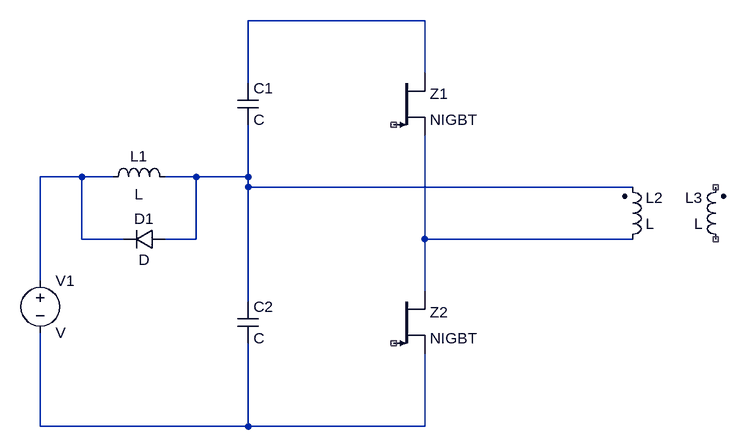
[diagram p0: schematic simulation_ltspice.asc]
simulation_ltspice.asc, the LTspice schematic file:
Version 4
SHEET 1 880 680
WIRE 352 48 80 48
WIRE 352 128 352 48
WIRE 80 144 80 48
WIRE -176 288 -240 288
WIRE -128 288 -176 288
WIRE 0 288 -48 288
WIRE 80 288 80 208
WIRE 80 288 0 288
WIRE 80 304 80 288
WIRE 672 304 80 304
WIRE -176 384 -176 288
WIRE -112 384 -176 384
WIRE 0 384 0 288
WIRE 0 384 -48 384
WIRE 352 384 352 224
WIRE 672 384 352 384
WIRE -240 448 -240 288
WIRE 352 464 352 384
WIRE 80 480 80 304
WIRE -240 672 -240 528
WIRE 80 672 80 544
WIRE 80 672 -240 672
WIRE 352 672 352 560
WIRE 352 672 80 672
SYMBOL Misc/NIGBT 304 128 R0
SYMATTR InstName Z1
SYMBOL Voltage -240 432 R0
SYMATTR InstName V1
SYMBOL ind -144 304 R270
WINDOW 0 32 56 VTop 2
WINDOW 3 5 56 VBottom 2
SYMATTR InstName L1
SYMBOL Diode -48 368 R90
WINDOW 0 0 32 VBottom 2
WINDOW 3 32 32 VTop 2
SYMATTR InstName D1
SYMBOL Misc/NIGBT 304 464 R0
SYMATTR InstName Z2
SYMBOL Cap 64 144 R0
SYMATTR InstName C1
SYMBOL Cap 64 480 R0
SYMATTR InstName C2
SYMBOL ind2 656 400 M180
WINDOW 0 36 80 Left 2
WINDOW 3 36 40 Left 2
SYMATTR InstName L2
SYMBOL ind2 816 400 R180
WINDOW 0 36 80 Left 2
WINDOW 3 36 40 Left 2
SYMATTR InstName L3

The netlist it stands for:
* simulation_ltspice.asc
Z1 N001 NC_01 N004 NIGBT
V1 N002 N005 V
L1 N002 N003 L
D1 N003 N002 D
Z2 N004 NC_02 N005 NIGBT
C1 N001 N003 C
C2 N003 N005 C
L2 N004 N003 L
L3 NC_03 NC_04 L
.model D D
.lib standard.dio
.backanno
.end